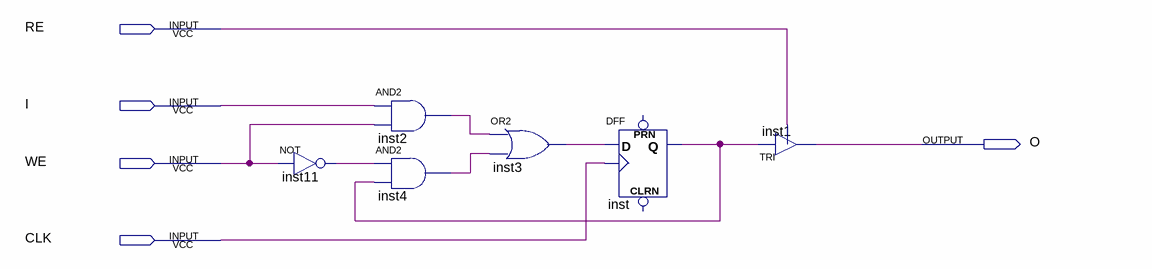
[diagram p0: schematic sheet]
// Quartus schematic ram_cell.bdf as structural Verilog: 6 symbols, 5 pins
module ram_cell (
  input  RE,
  input  I,
  input  WE,
  input  CLK,
  output O
);

  wire inst2_out, inst3_out, inst4_out, inst11_out, inst_q;

  not inst11 (inst11_out, WE);
  and inst2 (inst2_out, I, WE);
  and inst4 (inst4_out, inst11_out, inst_q);
  or inst3 (inst3_out, inst2_out, inst4_out);
  DFF inst (.CLK(CLK), .D(inst3_out), .Q(inst_q));  // open: CLRN, PRN
  TRI inst1 (.IN(inst_q), .OE(RE), .OUT(O));
endmodule
